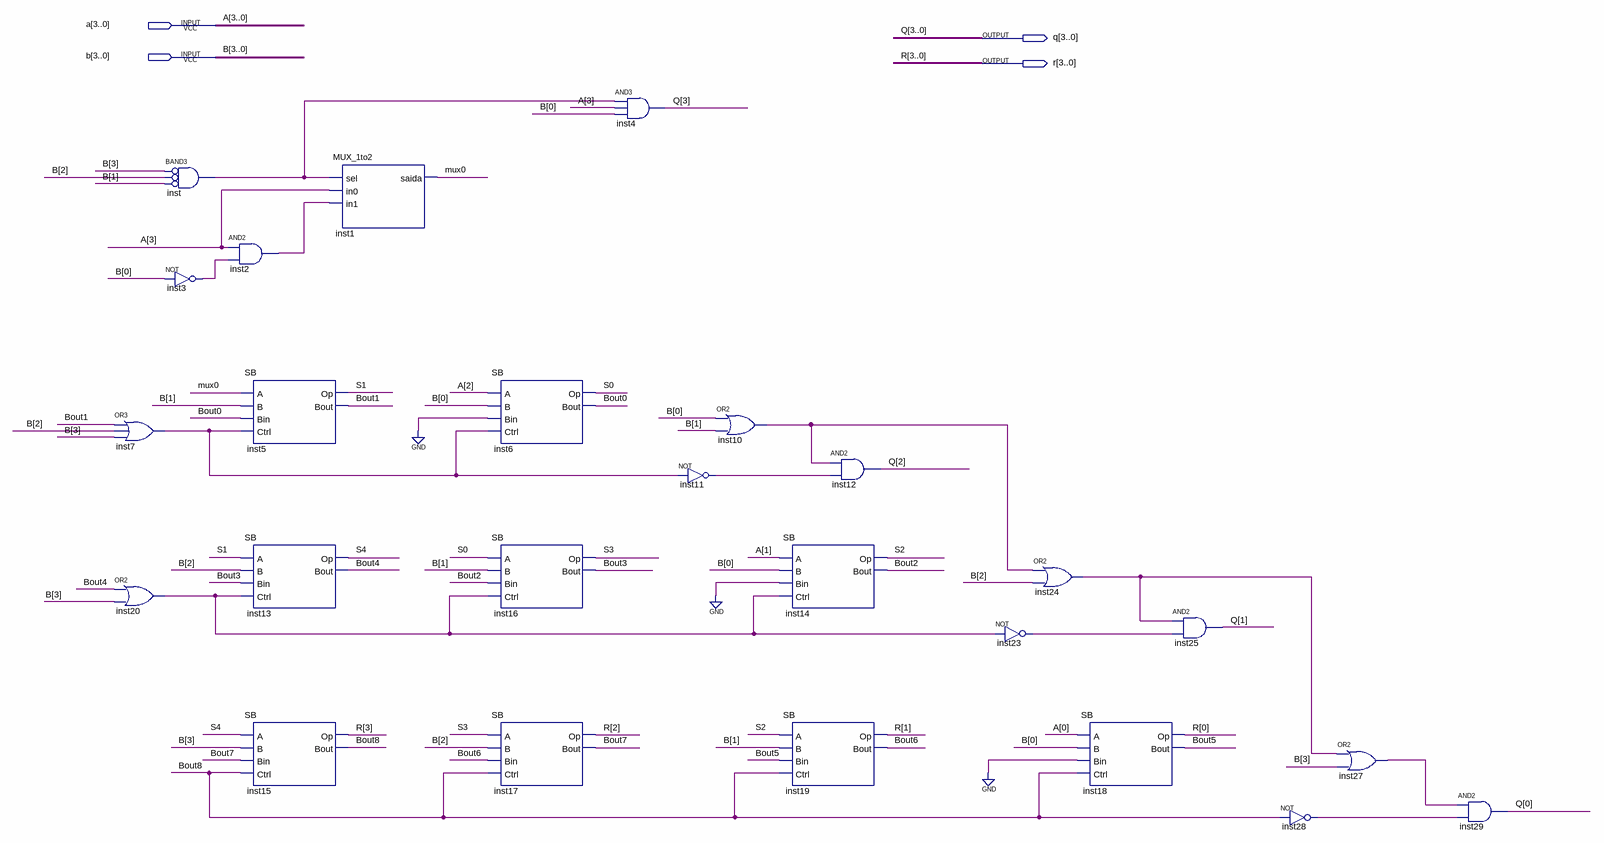
[diagram p0: schematic sheet]
// Quartus schematic Dividy4bit.bdf as structural Verilog: 25 symbols, 4 pins
module Dividy4bit (
  input  [3:0] a,
  input  [3:0] b,
  output [3:0] q,
  output [3:0] r
);

  wire Bout0, Bout1, Bout2, Bout3, Bout4, Bout5, Bout6, Bout7, Bout8, inst2_out, inst3_out, inst7_out,
       inst10_out, inst11_out, inst20_out, inst23_out, inst24_out, inst27_out, inst28_out, inst_out, mux0,
       S0, S1, S2, S3, S4;

  or inst7 (inst7_out, Bout1, b[2], b[3]);
  or inst20 (inst20_out, Bout4, b[3]);
  and inst (inst_out, ~b[3], ~b[2], ~b[1]);  // BAND3
  not inst3 (inst3_out, b[0]);
  and inst2 (inst2_out, a[3], inst3_out);
  SB inst5 (.A(mux0), .B(b[1]), .Bin(Bout0), .Ctrl(inst7_out), .Op(S1), .Bout(Bout1));
  SB inst13 (.A(S1), .B(b[2]), .Bin(Bout3), .Ctrl(inst20_out), .Op(S4), .Bout(Bout4));
  SB inst15 (.A(S4), .B(b[3]), .Bin(Bout7), .Ctrl(Bout8), .Op(r[3]), .Bout(Bout8));
  MUX_1to2 inst1 (.sel(inst_out), .in0(a[3]), .in1(inst2_out), .saida(mux0));
  SB inst6 (.A(a[2]), .B(b[0]), .Bin(1'b0), .Ctrl(inst7_out), .Op(S0), .Bout(Bout0));
  SB inst16 (.A(S0), .B(b[1]), .Bin(Bout2), .Ctrl(inst20_out), .Op(S3), .Bout(Bout3));
  SB inst17 (.A(S3), .B(b[2]), .Bin(Bout6), .Ctrl(Bout8), .Op(r[2]), .Bout(Bout7));
  and inst4 (q[3], inst_out, a[3], b[0]);
  not inst11 (inst11_out, inst7_out);
  or inst10 (inst10_out, b[0], b[1]);
  SB inst14 (.A(a[1]), .B(b[0]), .Bin(1'b0), .Ctrl(inst20_out), .Op(S2), .Bout(Bout2));
  SB inst19 (.A(S2), .B(b[1]), .Bin(Bout5), .Ctrl(Bout8), .Op(r[1]), .Bout(Bout6));
  and inst12 (q[2], inst10_out, inst11_out);
  not inst23 (inst23_out, inst20_out);
  or inst24 (inst24_out, inst10_out, b[2]);
  SB inst18 (.A(a[0]), .B(b[0]), .Bin(1'b0), .Ctrl(Bout8), .Op(r[0]), .Bout(Bout5));
  and inst25 (q[1], inst24_out, inst23_out);
  not inst28 (inst28_out, Bout8);
  or inst27 (inst27_out, inst24_out, b[3]);
  and inst29 (q[0], inst27_out, inst28_out);
endmodule
